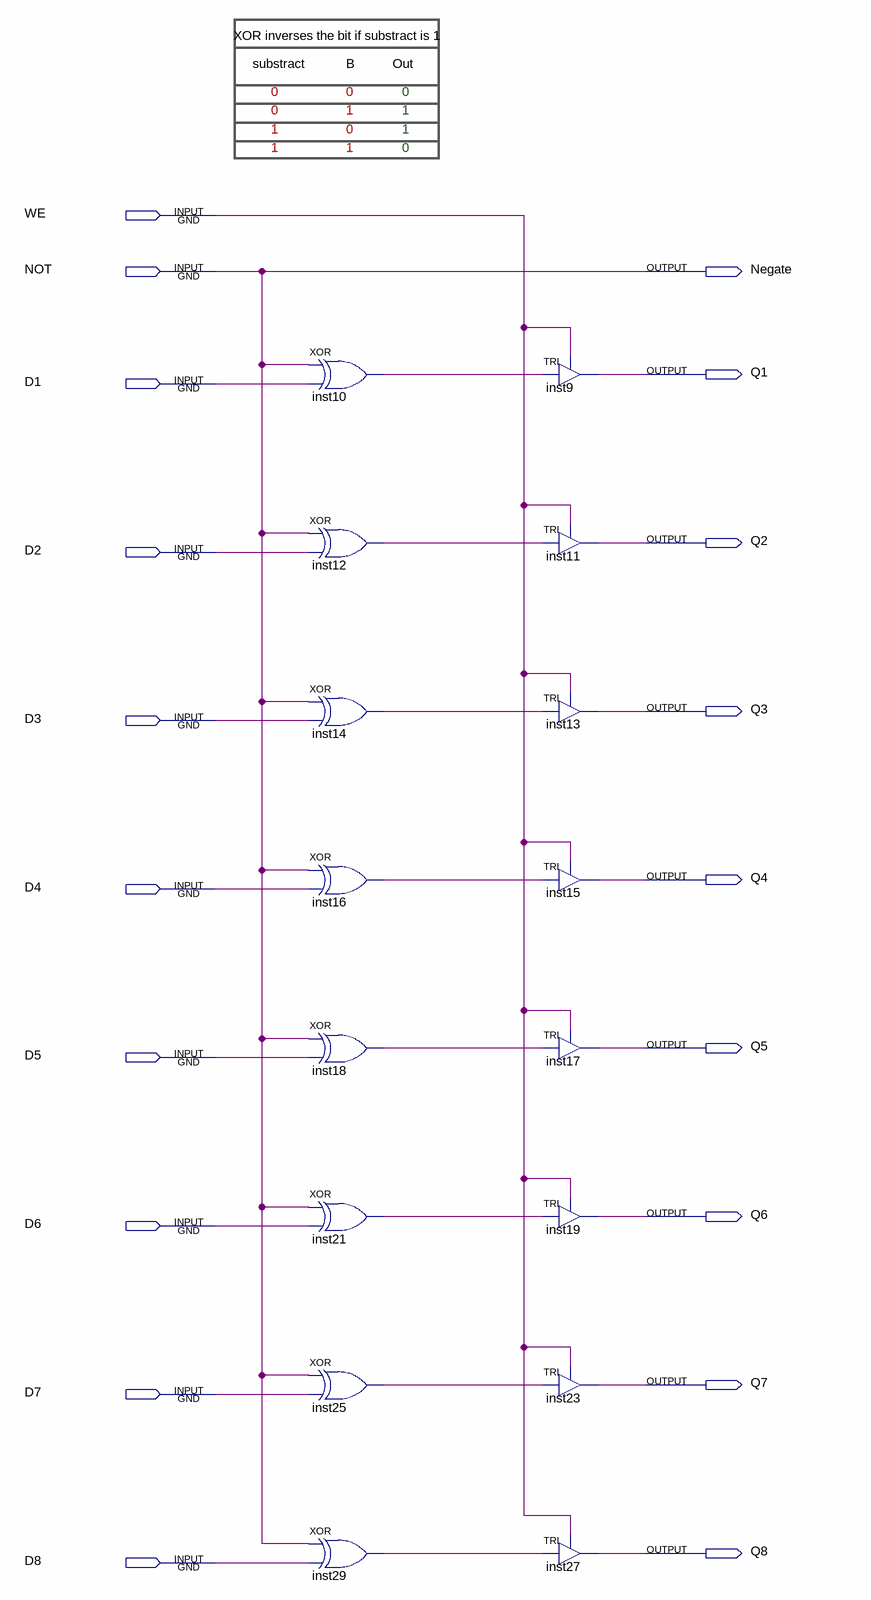
[diagram p0: schematic sheet]
// Quartus schematic Inverse_Bits.bdf as structural Verilog: 16 symbols, 19 pins
module Inverse_Bits (
  input  WE,
  input  NOT,
  input  D1,
  input  D2,
  input  D3,
  input  D4,
  input  D5,
  input  D6,
  input  D7,
  input  D8,
  output Negate,
  output Q1,
  output Q2,
  output Q3,
  output Q4,
  output Q5,
  output Q6,
  output Q7,
  output Q8
);

  wire inst10_out, inst12_out, inst14_out, inst16_out, inst18_out, inst21_out, inst25_out, inst29_out;

  xor inst10 (inst10_out, NOT, D1);
  xor inst12 (inst12_out, NOT, D2);
  xor inst14 (inst14_out, NOT, D3);
  xor inst16 (inst16_out, NOT, D4);
  xor inst18 (inst18_out, NOT, D5);
  xor inst21 (inst21_out, NOT, D6);
  xor inst25 (inst25_out, NOT, D7);
  xor inst29 (inst29_out, NOT, D8);
  TRI inst9 (.IN(inst10_out), .OE(WE), .OUT(Q1));
  TRI inst11 (.IN(inst12_out), .OE(WE), .OUT(Q2));
  TRI inst13 (.IN(inst14_out), .OE(WE), .OUT(Q3));
  TRI inst15 (.IN(inst16_out), .OE(WE), .OUT(Q4));
  TRI inst17 (.IN(inst18_out), .OE(WE), .OUT(Q5));
  TRI inst19 (.IN(inst21_out), .OE(WE), .OUT(Q6));
  TRI inst23 (.IN(inst25_out), .OE(WE), .OUT(Q7));
  TRI inst27 (.IN(inst29_out), .OE(WE), .OUT(Q8));

  assign Negate = NOT;

  // Notes on the sheet:
  //   XOR inverses the bit if substract is 1
  //   substract
  //   B
  //   Out
  //   0
  //   0
  //   0
  //   0
  //   1
  //   1
  //   1
  //   0
  //   1
  //   1
  //   1
  //   0
endmodule
